# EAGLE design Rotary_Switch_Potentiometer (EAGLE 7.1.0)
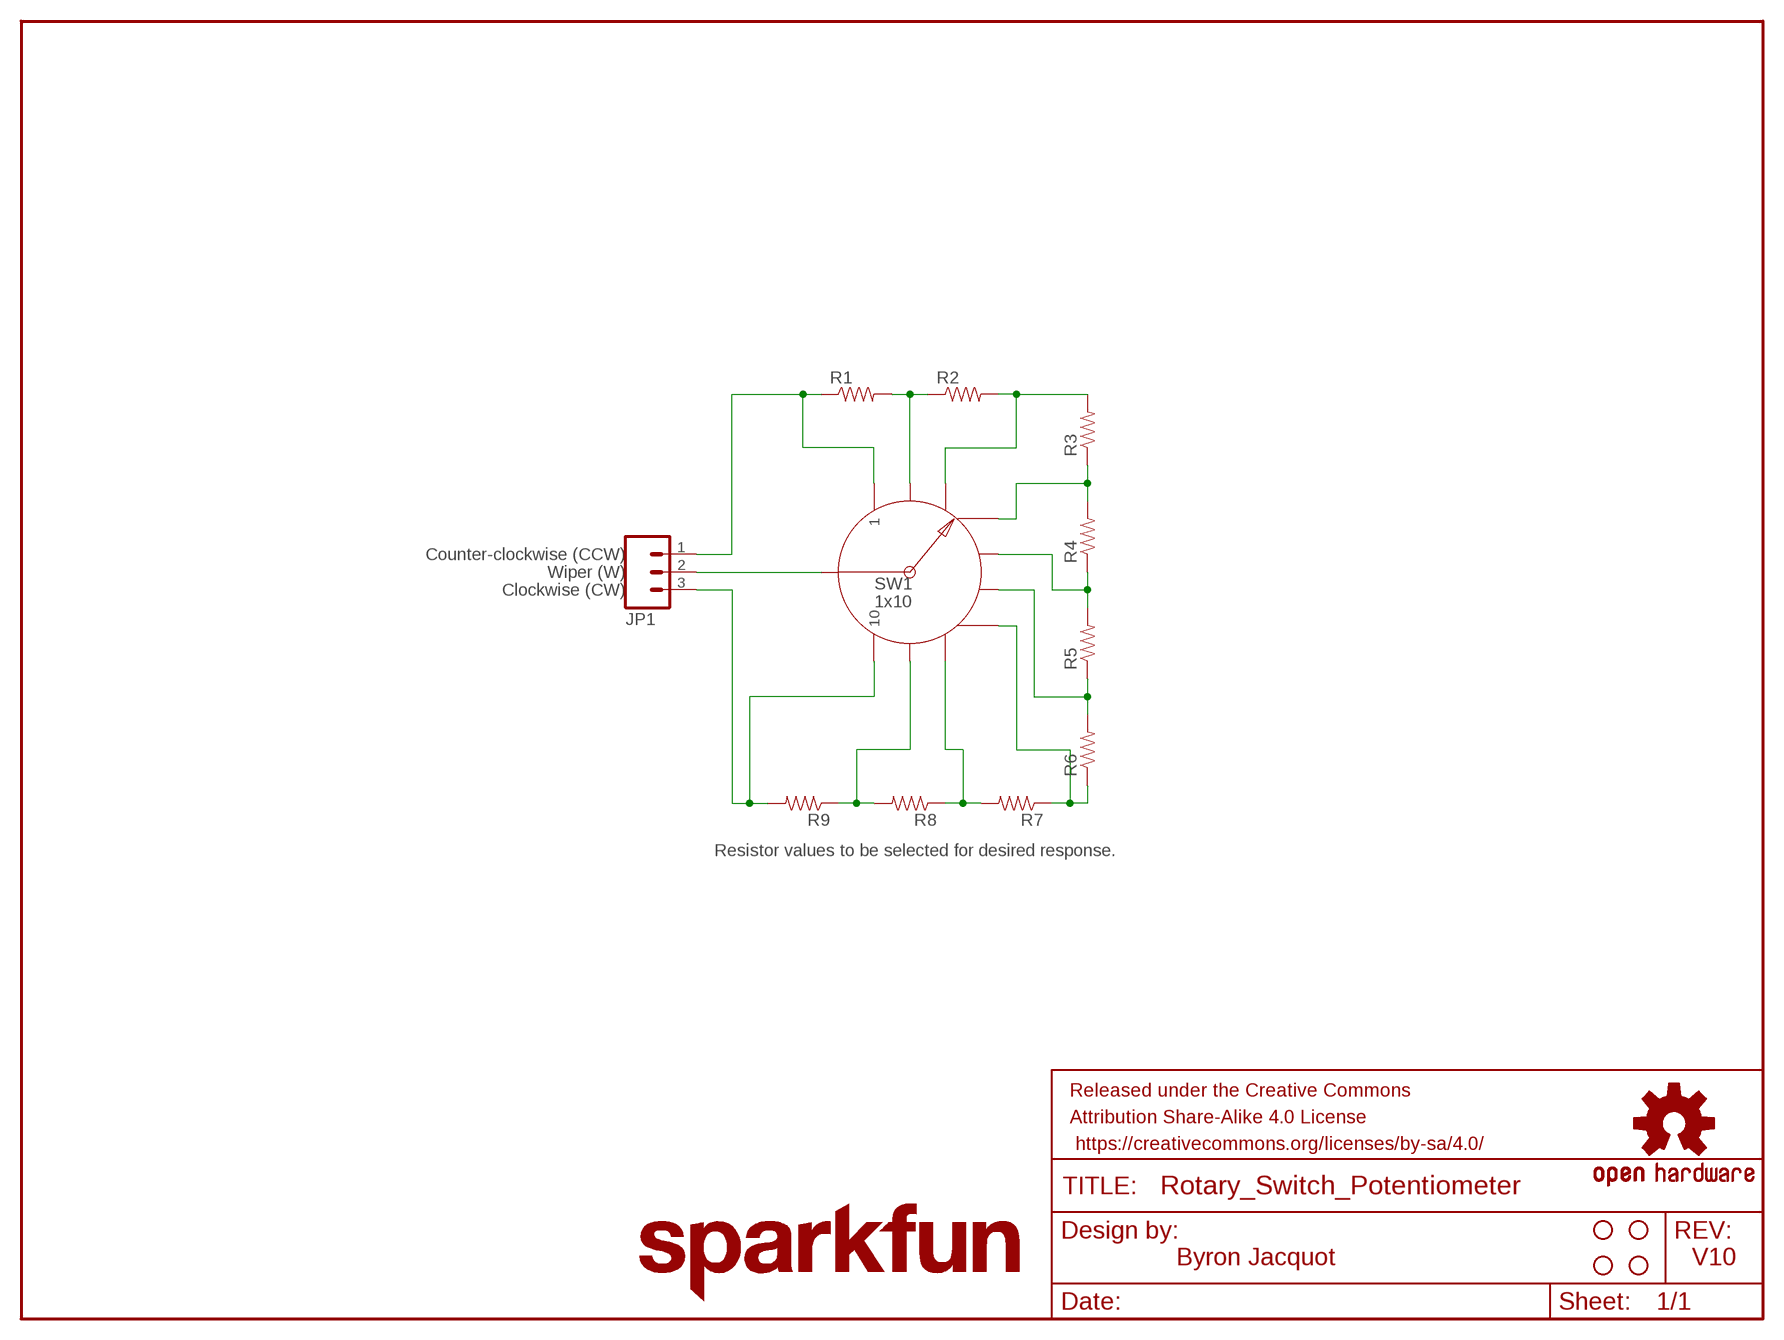
[diagram p0: schematic, sheet 1]

## Parts
FRAME1  FRAME-LETTER  [CREATIVE_COMMONS]
JP1  M031X03_NO_SILK  [1X03_NO_SILK]
LOGO1  OSHW-LOGOM  [OSHW-LOGO-M]
LOGO3  SFE_LOGO_NAME.1_INCH  [SFE_LOGO_NAME_.1]
R1  RESISTORPTH-1/4W-VERT-KIT  [AXIAL-0.1EZ]
R2  RESISTORPTH-1/4W-VERT-KIT  [AXIAL-0.1EZ]
R3  RESISTORPTH-1/4W-VERT-KIT  [AXIAL-0.1EZ]
R4  RESISTORPTH-1/4W-VERT-KIT  [AXIAL-0.1EZ]
R5  RESISTORPTH-1/4W-VERT-KIT  [AXIAL-0.1EZ]
R6  RESISTORPTH-1/4W-VERT-KIT  [AXIAL-0.1EZ]
R7  RESISTORPTH-1/4W-VERT-KIT  [AXIAL-0.1EZ]
R8  RESISTORPTH-1/4W-VERT-KIT  [AXIAL-0.1EZ]
R9  RESISTORPTH-1/4W-VERT-KIT  [AXIAL-0.1EZ]
STANDOFF1  STAND-OFF  [STAND-OFF]
STANDOFF2  STAND-OFF  [STAND-OFF]
STANDOFF5  STAND-OFF  [STAND-OFF]
STANDOFF6  STAND-OFF  [STAND-OFF]
SW1  1x10  SWITCH_ROTARY_1X10KIT  [ROTARY_SWITCH_1X10_KIT]

## Nets
N$1: JP1.2 SW1.COMMON
N$2: JP1.1 R1.P$1 SW1.1
N$3: JP1.3 R9.P$2 SW1.10
N$4: R7.P$2 R8.P$1 SW1.8
N$5: R1.P$2 R2.P$1 SW1.2
N$6: R2.P$2 R3.P$2 SW1.3
N$7: R3.P$1 R4.P$2 SW1.4
N$8: R4.P$1 R5.P$2 SW1.5
N$9: R5.P$1 R6.P$2 SW1.6
N$10: R6.P$1 R7.P$1 SW1.7
N$11: R8.P$2 R9.P$1 SW1.9

## Notes on the sheet
- Counter-clockwise (CCW)
- Wiper (W)
- Clockwise (CW)
- Resistor values to be selected for desired response.
- Byron Jacquot | V10

## Library data of the parts
FRAME1 = SparkFun-Aesthetics:FRAME-LETTER: Schematic Frame Standard 8.5x11 US Letter frame
JP1 = SparkFun-Connectors:M03: Header 3 Standard 3-pin 0.1" header. Use with straight break away headers (SKU : PRT-00116), right angle break away headers (PRT-00553), swiss pins (PRT-00743), machine pins (PRT-00117), and female headers (PRT-00115). Molex polarized connector foot print use with SKU : PRT-08232 with associated crimp pins and housings.
LOGO1 = SparkFun-Aesthetics:OSHW-LOGO: Open Source Hardware Logo This logo indicates the piece of hardware it is found on incorporates a OSHW license and/or adheres to the definition of open source hardware found here: http://freedomdefined.org/OSHW
LOGO3 = SparkFun-Aesthetics:SFE_LOGO_NAME: SFE Logo, name only This is the SparkFun name logo. The logo on the schematic will always be the same size; the package variant is the height of the flame part of the logo (or the height the flame would be, if it were drawn). Default layer for the logo on the board is tSilk.
R1-R9 = SparkFun-Resistors:RESISTOR: Resistor Basic schematic elements and footprints for 0603, 1206, and PTH resistors.
STANDOFF1 STANDOFF2 STANDOFF5 STANDOFF6 = SparkFun-Electromechanical:STAND-OFF: #4 Stand Off This is the mechanical footprint for a #4 phillips button head screw. Use the keepout ring to avoid running the screw head into surrounding components. SKU : PRT-00447
SW1 = SparkFun-Electromechanical:SWITCH_ROTARY_1X10: SWCH-12120; PROD_ID: SWCH-12120

## Board
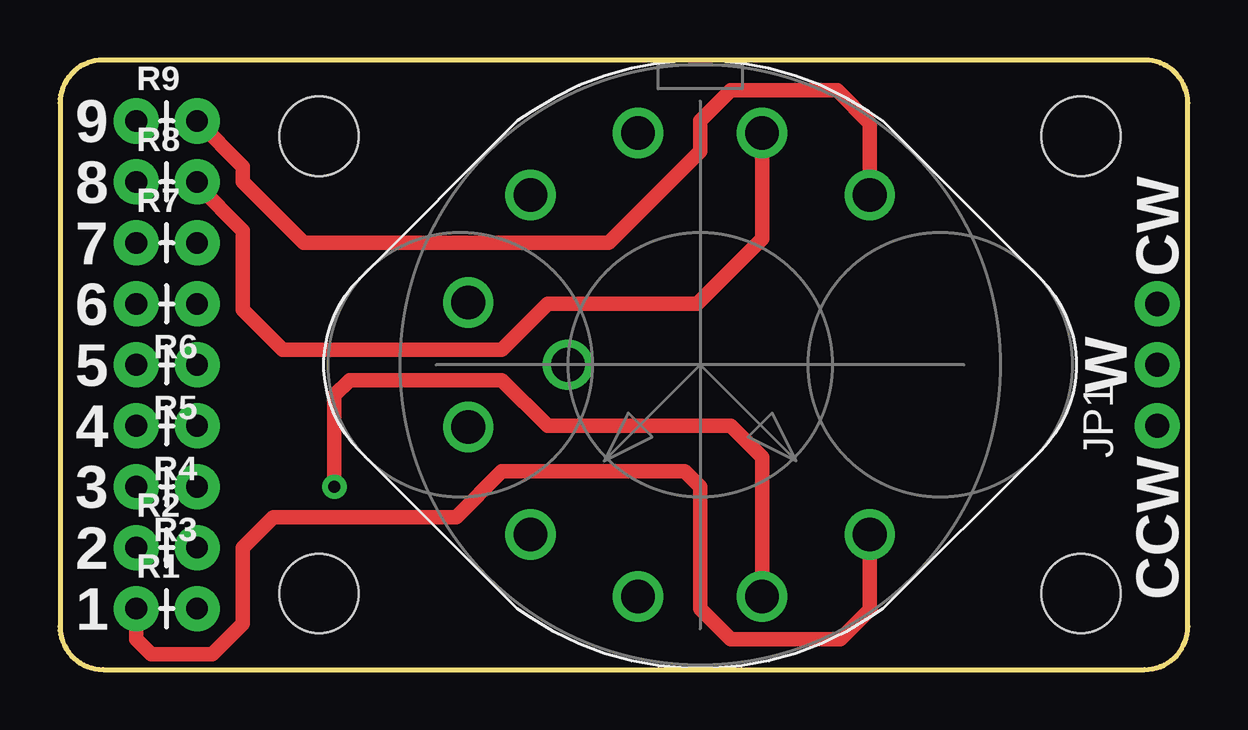
[diagram p1: board, top side]
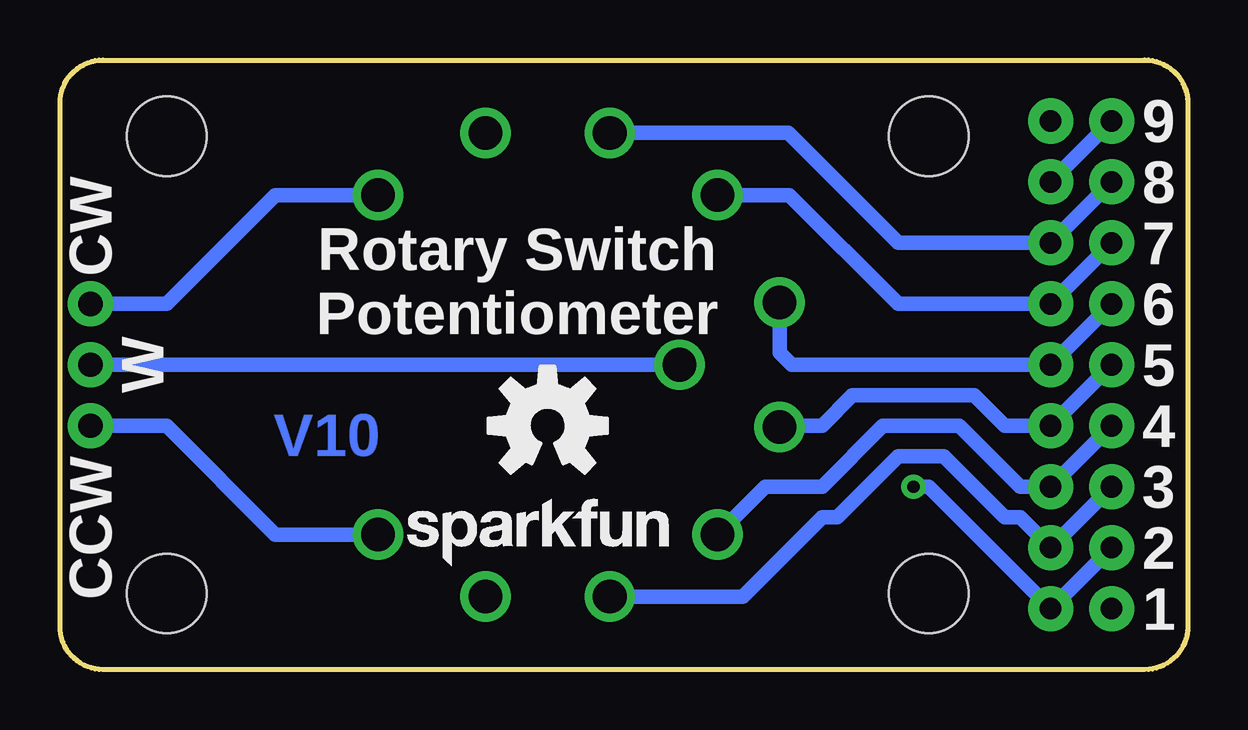
[diagram p2: board, bottom side, seen from below]

Size 46.99 x 25.4 mm. Coordinates in mm from the lower left corner, seen from the top.
Outline: 46.99,1.8 46.99,23.6 arc90 45.19,25.4 1.8,25.4 arc90 0,23.6 0,1.8 arc90 1.8,0 45.19,0 arc90 46.99,1.8
Copper layers (1*16): Top 0.035mm / dielectric 1.5mm / Bottom 0.035mm
Design rules "SparkFun-2-layer": minimum track width 7mil, minimum drill 15mil, track to track 8mil, track to pad 8mil, pad to pad 8mil, via to via 8mil, smd to smd 8mil, copper to edge 8mil, drill to drill 8mil, minimum pad ring 12mil, minimum via ring 10mil, stop-mask expansion 4mil, vias tented up to drill 20mil, thermal gap 10mil

### Footprints (pad centres in the part's own frame; a part is rotated, then mirrored left to right if it is on the bottom)
1X03_NO_SILK = drill 1.016 pad 1.88: 1 0,0; 2 2.54,0; 3 5.08,0
AXIAL-0.1EZ = drill 0.9 pad 1.88: P$1 0,0; P$2 2.54,0
STAND-OFF = hole 3.302: 0,0
ROTARY_SWITCH_1X10_KIT = drill 1.4: 1 7.071,7.071; 2 9.659,2.588; 3 9.659,-2.588; 4 7.071,-7.071; 5 2.588,-9.659; 6 -2.588,-9.659; 7 -7.071,-7.071; 8 -9.659,-2.588; 9 -9.659,2.588; 10 -7.071,7.071; COMMON 0,-5.5

### Placement (x,y rotation side)
FRAME1  0,-13.97 0 top  (outside the outline)
JP1  45.72,10.16 90 top
LOGO1  26.67,10.16 0 bottom
LOGO3  33.02,3.81 0 bottom
R1  3.17,2.54 0 top
R2  3.17,5.08 0 top
R3  5.71,7.62 180 top
R4  5.71,10.16 180 top
R5  5.71,12.7 180 top
R6  5.71,15.24 180 top
R7  3.17,17.78 0 top
R8  3.17,20.32 0 top
R9  3.17,22.86 0 top
STANDOFF1  42.55,3.17 0 top
STANDOFF2  42.55,22.23 0 top
STANDOFF5  10.79,22.23 0 top
STANDOFF6  10.79,3.17 0 top
SW1  26.67,12.7 270 top

### Tracks (layer width: path | path; a pad name or v marks a point on that pad's centre or on a via)
N$1
  Bottom 0.61: JP1.2 SW1.COMMON
N$2
  Top 0.61: SW1.1 33.74,2.58 33.78,2.54 32.51,1.27 27.94,1.27 26.67,2.54 26.67,7.62 26.04,8.26 18.41,8.26 16.51,6.35 8.89,6.35 7.62,5.08 7.62,1.91 6.35,0.64 3.81,0.64 3.17,1.27 R1.P$1
  Bottom 0.61: JP1.1 42.55,10.16 38.01,5.63 SW1.1
N$3
  Top 0.61: SW1.10 33.74,22.77 32.38,24.13 27.94,24.13 26.67,22.86 26.67,21.59 22.86,17.78 10.16,17.78 7.62,20.32 7.62,20.95 R9.P$2
  Bottom 0.61: JP1.3 42.55,15.24 38.01,19.77 SW1.10
N$4
  Bottom 0.61: R8.P$1 R7.P$2 12.06,17.78 16.64,22.36 SW1.8
N$5  (via drill 0.51)
  Top 0.61: SW1.2 29.26,8.84 27.94,10.16 20.32,10.16 18.41,12.06 12.06,12.06 11.43,11.43 v11.43,7.62
  Bottom 0.61: R2.P$1 R1.P$2 10.79,7.62 v11.43,7.62
N$6
  Bottom 0.61: R3.P$2 R2.P$2 6.99,6.35 7.62,6.35 10.16,8.89 12.06,8.89 14.61,6.35 15.24,6.35 18.55,3.04 SW1.3
N$7
  Bottom 0.61: R4.P$2 R3.P$1 6.99,7.62 9.53,10.16 12.7,10.16 15.24,7.62 17.61,7.62 SW1.4
N$8
  Bottom 0.61: R5.P$2 R4.P$1 7.62,10.16 8.89,11.43 13.97,11.43 15.24,10.16 16.96,10.16 SW1.5
N$9
  Bottom 0.61: R6.P$2 R5.P$1 16.51,12.7 17.01,13.2 SW1.6
N$10
  Bottom 0.61: R7.P$1 R6.P$1 12.06,15.24 16.6,19.77 SW1.7
N$11
  Top 0.61: SW1.9 29.26,17.95 26.54,15.24 20.32,15.24 18.41,13.34 9.27,13.34 7.62,14.99 7.62,18.29 5.71,20.19 R8.P$2
  Bottom 0.61: R8.P$2 R9.P$1

### Text on the board
Bottom: V10
tPlace: 9 | 8 | 7 | CW | 6 | 5 | W | 4 | CCW | 3 | 2 | 1
bPlace: 9 | 8 | 7 | Rotary Switch / Potentiometer | CW | 6 | 5 | W | 4 | CCW | 3 | 2 | 1
Measures: 4x 0.13 diam. | 0.35 diam panel hole | All units in Inches
tDocu: Byron Jacquot